# Altium schematic sheet MissingLink.SchDoc: MissingLink
size Tabloid; CompanyName: afasfe; Organization: Electric Ray Engineering; Address1: asdf; Address2: http://torpediniformes.com/; Address3: asdf; Address4: asdf; Revision: NOV2018; SheetNumber: 1; SheetTotal: 1; PageSetup: Record=PageOptions|CenterHorizontal=True|CenterVertical=True|PrintScale=0.98|XCorrection=1.00|YCorrection=1.00|PrintKind=0|BorderSize=5000000|LeftOffset=0|BottomOffset=0|Orientation=2|PaperLength=1000|PaperWidth=1000|Scale=100|PaperSource=7|PrintQuality=-3|MediaType=1|DitherType=10|PrintScaleMode=1|PaperKind=Tabloid (11 x 17 in)|PaperIndex=3
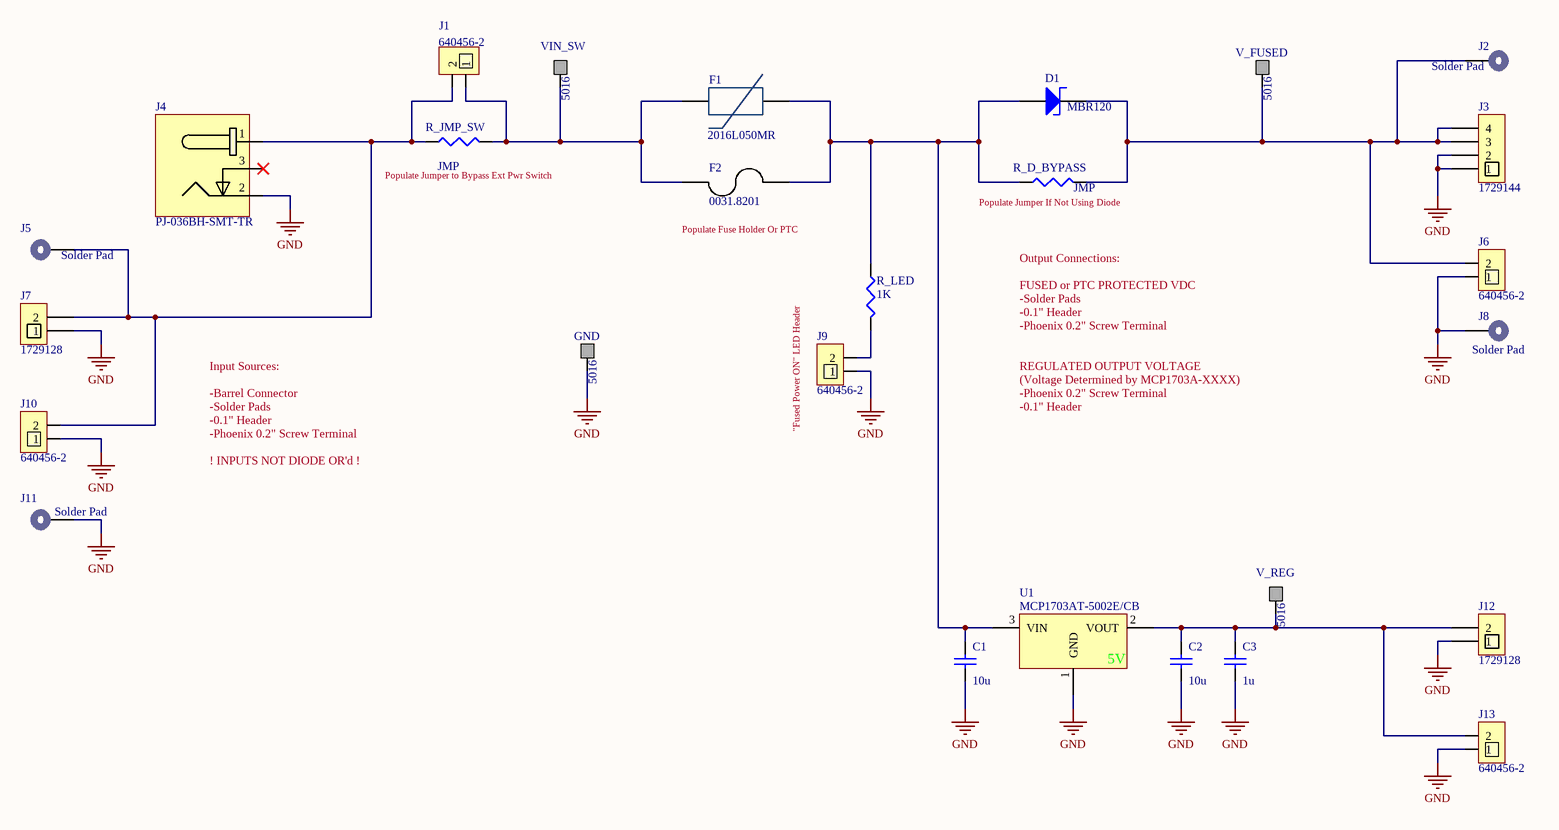
[diagram p0: MissingLink.SchDoc]

## Parts
C1  value 10u  [C1206]  (hidden comment: Cap Semi)
C2  value 10u  [C1206]  (hidden comment: Cap Semi)
C3  value 1u  [C1206]  (hidden comment: Cap Semi)
D1  Diode  [SOD-123FL]  (value not drawn)
F1  2016L050MR  [PolyFuse_2016L]
F2  0031.8201  [0031.8201]
GND  5016  [5016]
J1  640456-2  [640456-2]
J2  Solder Pad  [61mil_Solder_Hole]
J3  1729144  [1729144_PHX_4]
J4  PJ-036BH-SMT-TR  [PJ-036BH-SMT-TR]
J5  Solder Pad  [61mil_Solder_Hole]
J6  640456-2  [640456-2]
J7  1729128  [1729128_PHX_2]
J8  Solder Pad  [61mil_Solder_Hole]
J9  640456-2  [640456-2]
J10  640456-2  [640456-2]
J11  Solder Pad  [61mil_Solder_Hole]
J12  1729128  [1729128_PHX_2]
J13  640456-2  [640456-2]
R_D_BYPASS  value JMP  [0805_L]  (hidden comment: Res3)
R_JMP_SW  value JMP  [0805_L]  (hidden comment: Res3)
R_LED  value 1K  [0805_L]  (hidden comment: Res3)
U1  MCP1703AT-5002E/CB  [SOT-23A]
V_FUSED  5016  [5016]
V_REG  5016  [5016]
VIN_SW  5016  [5016]

## Nets
GND: C1.1 C2.1 C3.1 GND.1 J3.1 J3.2 J4.2 J6.1 J7.1 J8.1 J9.1 J10.1 J11.1 J12.1 J13.1 U1.1(GND)
NetC1_2: C1.2 D1.A F1.2 F2.2 R_D_BYPASS.1 R_LED.2 U1.3(VIN)
NetC2_2: C2.2 C3.2 J12.2 J13.2 U1.2(VOUT) V_REG.1
NetD1_K: D1.K J2.1 J3.3 J3.4 J6.2 R_D_BYPASS.2 V_FUSED.1
NetF1_1: F1.1 F2.1 J1.1 R_JMP_SW.2 VIN_SW.1
NetJ1_2: J1.2 J4.1 J5.1 J7.2 J10.2 R_JMP_SW.1
NetJ9_2: J9.2 R_LED.1

Not connected (* = marked no-connect by the designer): J4 3*

## Notes on the sheet
- (near R_JMP_SW) Populate Jumper to Bypass Ext Pwr Switch
- (near R_D_BYPASS) Populate Jumper If Not Using Diode
- (near F2) Populate Fuse Holder Or PTC
- (near J9) "Fused Power ON" LED Header
- Output Connections:
  FUSED or PTC PROTECTED VDC
  -Solder Pads
  -0.1" Header
  -Phoenix 0.2" Screw Terminal
  REGULATED OUTPUT VOLTAGE
  (Voltage Determined by MCP1703A-XXXX)
  -Phoenix 0.2" Screw Terminal
  -0.1" Header
- Input Sources:
  -Barrel Connector
  -Solder Pads
  -0.1" Header
  -Phoenix 0.2" Screw Terminal
  ! INPUTS NOT DIODE OR'd !
- Title
- Size:
- Date:
- Tabloid
- Number:
- Time:
- Revision:
- Sheet
- of
- File:
- (in symbol MCP1703AT-5002E/CB) 5V

## Library data of the parts
C1-C3 = Cap Semi: Capacitor (Semiconductor SIM Model); Published: 8-Jun-2000; LatestRevisionDate: 29-May-2009; LatestRevisionNote: IPC-7351 Footprint Added.; PackageReference: C1206; Publisher: Altium Limited; PackageDescription: Chip Capacitor
D1 = MBR120: DIODE SCHOTTKY 20V 1A SOD123FL; Manufacturer: ON Semiconductor; Manufacturer Part Number: MBR120
F1 = PTC_2016L050MR_LITTELFUSE: 600mA PTC; Manufacturer: Littelfuse Inc.; Manufacturer Part Number: 2016L050MR
F2 = 0031.8201: FUSE BLOK CARTRIDGE 500V 10A PCB; Manufacturer: Schurter; Manufacturer Part Number: 0031.8201
GND V_FUSED V_REG VIN_SW = 5016: PC TEST POINT COMPACT SMD; Manufacturer: Keystone Electronics; Manufacturer Part Number: 5016
J1 J6 J9 J10 J13 = 640456-2: CONN HEADER VERT 2POS .100 TIN; Manufacturer: TE Connectivity AMP Connectors; Manufacturer Part Number: 640456-2
J2 J5 J8 J11 = Solderable_Hole: A Solderable Pad
J3 = 1729144: CONN TERM BLOCK 4POS 5.08MM PCB; Manufacturer: Phoenix Connect; Manufacturer Part Number: 1729144
J4 = PJ-036BH-SMT-TR: CONN PWR JACK 2.5X5.5MM SOLDER; Manufacturer: CUI; Manufacturer Part Number: PJ-036BH-SMT-TR
J7 J12 = 1729128: CONN TERM BLOCK 2POS 5.08MM PCB; Manufacturer: Phoenix Connect; Manufacturer Part Number: 1729128
R_D_BYPASS R_JMP_SW R_LED = Res3: Resistor; Published: 8-Jun-2000; LatestRevisionDate: 29-May-2009; LatestRevisionNote: IPC-7351 Footprint Added.; PackageReference: J1-0603; Publisher: Altium Limited; PackageDescription: Chip Resistor
U1 = MCP1703AT-5002E/CB: IC REG LINEAR 5V 250MA SOT23A-3; Manufacturer: Microchip Technology; Manufacturer Part Number: MCP1703AT-5002E/CB